# EAGLE design BME280-Breakout_v13 (EAGLE 7.7.0)
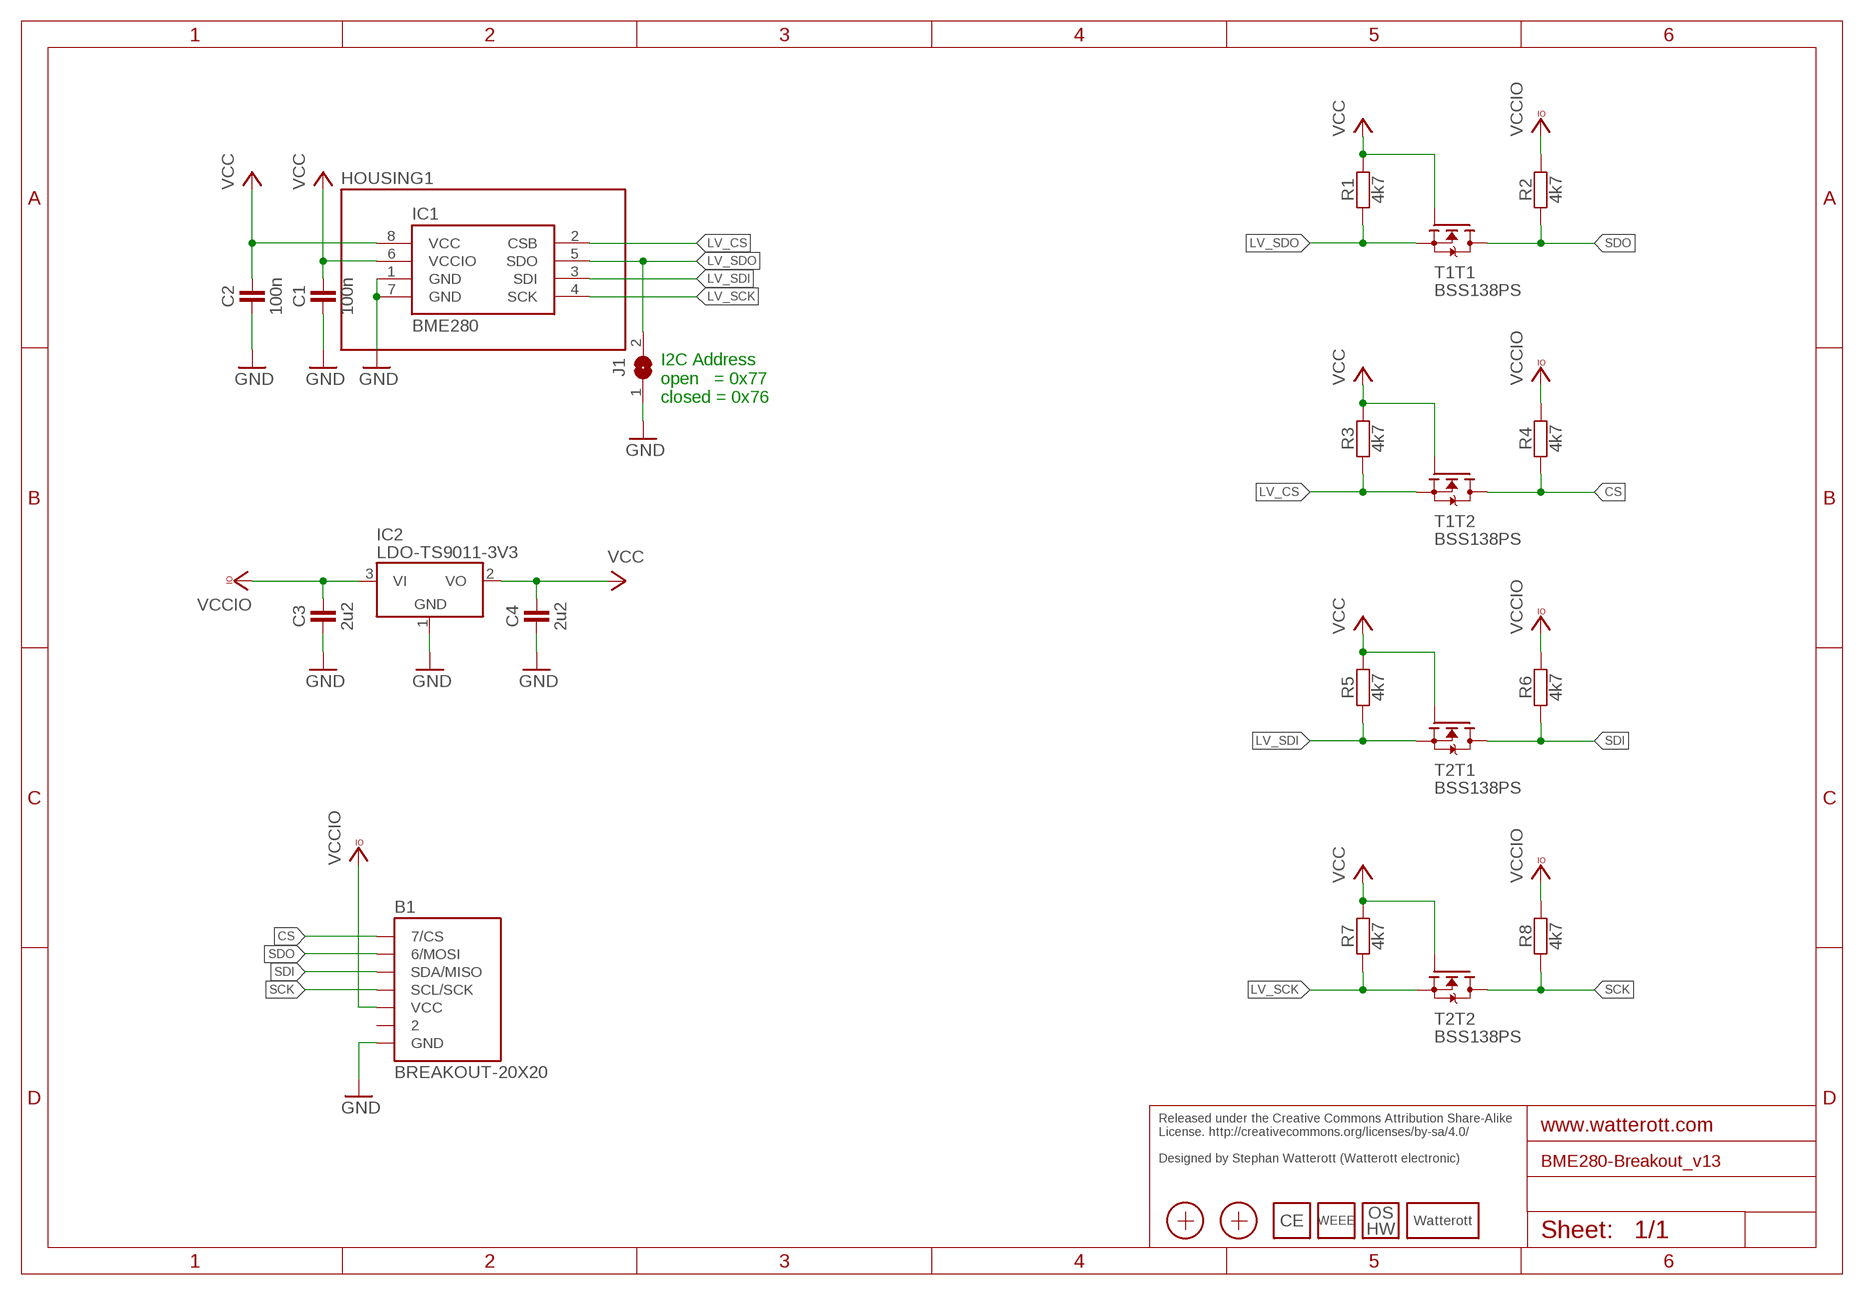
[diagram p0: schematic, sheet 1]

## Parts
B1  BREAKOUT-20X20  [BREAKOUT-20X20]
C1  100n  CAPACITOR-0402  [C0402]
C2  100n  CAPACITOR-0402  [C0402]
C3  2u2  CAPACITOR-0402  [C0402]
C4  2u2  CAPACITOR-0402  [C0402]
HOUSING1  SF2  [SF2]
IC1  BME280  [BME280]
IC2  LDO-TS9011-3V3  [SOT23]
J1  JUMPER2-0603  [JUMPER2-0603]
LOGO3  LOGO_CE-2  [CE_2MM]
LOGO4  LOGO_WEEE-4  [WEEE_4MM]
LOGO5  LOGO_SPARK-2  [SPARK_2MM]
LOGO6  LOGO_OSHW-2  [OSHW_2MM]
R1  4k7  RESISTOR-0402  [C0402]
R2  4k7  RESISTOR-0402  [C0402]
R3  4k7  RESISTOR-0402  [C0402]
R4  4k7  RESISTOR-0402  [C0402]
R5  4k7  RESISTOR-0402  [C0402]
R6  4k7  RESISTOR-0402  [C0402]
R7  4k7  RESISTOR-0402  [C0402]
R8  4k7  RESISTOR-0402  [C0402]
T1  BSS138PS  [SOT363]
T2  BSS138PS  [SOT363]
X1  PASSER-07  [PASSER_07MM]
X2  PASSER-07  [PASSER_07MM]

## Nets
CS: B1.CS(7/CS) R4.1 T1.3(T2:D)
GND: B1.GND C1.1 C2.1 C3.1 C4.1 IC1.1(GND) IC1.7(GND) IC2.1(GND) J1.1
LV_CS: IC1.2(CSB) R3.1 T1.4(T2:S)
LV_SCK: IC1.4(SCK) R7.1 T2.4(T2:S)
LV_SDI: IC1.3(SDI) R5.1 T2.1(T1:S)
LV_SDO: IC1.5(SDO) J1.2 R1.1 T1.1(T1:S)
SCK: B1.SCL/SCK R8.1 T2.3(T2:D)
SDI: B1.SDA/MISO R6.1 T2.6(T1:D)
SDO: B1.MOSI(6/MOSI) R2.1 T1.6(T1:D)
VCC: C1.2 C2.2 C4.2 IC1.6(VCCIO) IC1.8(VCC) IC2.2(VO) R1.2 R3.2 R5.2 R7.2 T1.2(T1:G) T1.5(T2:G) T2.2(T1:G) T2.5(T2:G)
VCCIO: B1.VCC C3.2 IC2.3(VI) R2.2 R4.2 R6.2 R8.2
Unconnected: B1.2

## Notes on the sheet
- I2C Address
  open   = 0x77
  closed = 0x76
- Released under the Creative Commons Attribution Share-Alike 
  License. http://creativecommons.org/licenses/by-sa/4.0/
  
  Designed by Stephan Watterott (Watterott electronic)

## Library data of the parts
B1 = we-board:BREAKOUT: Breakout Template
C1-C4 = we-rcl:CAPACITOR: Capacitor ...2.2uF @ 6.3V -> 0402 ...4.7uF @ 6.3V -> 0603 ...10uF @ 16V -> 0805 ...22uF @ 25V -> 1206
HOUSING1 = we-sensor:SF2: Sensirion SF2 Filter Cab (Housing for Humidity Sensors)
IC1 = we-sensor:BME280: Bosch BME280 Temperature, Pressure, Humidity Sensor
IC2 = we-power:LDO: LDOs TS1117 800mA, Vin max 12V - compatible NCP1117 1A, Vin max 20V TS9011 250mA, Vin max 12V - compatible AP2210 300mA, Vin max 15V TS5204 150mA, Vin max 16V
J1 = we-rcl:JUMPER2: 2-Pin Jumper
LOGO3 = we-symbol:LOGO_CE: CE Logo
LOGO4 = we-symbol:LOGO_WEEE: WEEE Logo
LOGO5 = we-symbol:LOGO_SPARK: Watterott electronic Logo
LOGO6 = we-symbol:LOGO_OSHW: Open-Source-Hardware Logo
R1-R8 = we-rcl:RESISTOR: Resistor all kinds in 0402 and 0603
T1 T2 = we-transistor:BSS138PS: BSS138 Dual N-Channel MOSFET (UGS +/-20V, RDS 1Ohm, ID 320mA)
X1 X2 = we-symbol:PASSER: Fiducial Markers

## Board
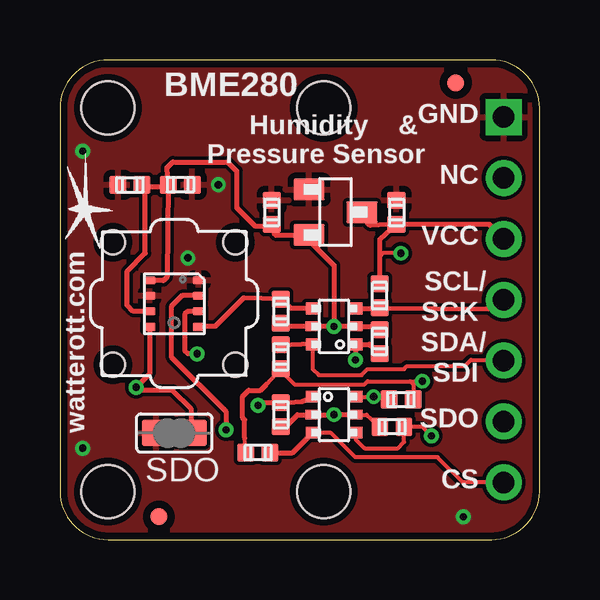
[diagram p1: board, top side]
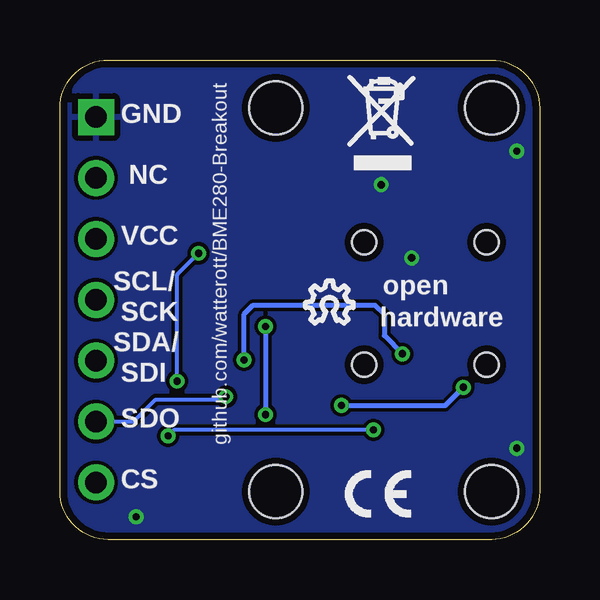
[diagram p2: board, bottom side, seen from below]

Size 20 x 20 mm. Coordinates in mm from the lower left corner, seen from the top.
Copper layers (1*16): Top 0.035mm / dielectric 1.5mm / Bottom 0.035mm
Design rules "we-dru-2-layer *": minimum track width 0.15mm, minimum drill 0.3mm, track to track 0.15mm, track to pad 0.15mm, pad to pad 0.15mm, via to via 0.15mm, smd to smd 0.1mm, copper to edge 0.3mm, drill to drill 0.2mm, minimum pad ring 0.18mm, minimum via ring 0.16mm, stop-mask expansion 0.1mm, vias tented up to drill 0.5mm, thermal gap 0.25mm
Holes 2.2 mm at 11,18 11,2

### Footprints (pad centres in the part's own frame; a part is rotated, then mirrored left to right if it is on the bottom)
BREAKOUT-20X20 = drill 0.9 pad 1.5: 2 18.5,15.08; CS 18.5,2.38; MOSI 18.5,4.92; SCL/SCK 18.5,10; SDA/MISO 18.5,7.46; VCC 18.5,12.54 | drill 0.9 pad 1.5 square: GND 18.5,17.62 | hole 2.2: 2,18; 2,2
C0402 = smd 0.75 x 0.7: 1 0,0.5; 2 0,-0.5
SF2 = hole 1: -2.55,-2.55; 2.55,-2.55; 2.55,2.55; -2.55,2.55
BME280 = smd 0.5 x 0.35: 1 1.025,0.975; 2 1.025,0.325; 3 1.025,-0.325; 4 1.025,-0.975; 5 -1.025,-0.975; 6 -1.025,-0.325; 7 -1.025,0.325; 8 -1.025,0.975
SOT23 = smd 1.3 x 0.9: 1 -1.1,0.95; 2 -1.1,-0.95; 3 1.1,0
JUMPER2-0603 = smd 1.1 x 1.2: 1 0,0.75; 2 0,-0.75
SOT363 = smd 0.6 x 0.5: 1 -0.9,0.75; 3 -0.9,-0.75; 4 0.9,-0.75; 6 0.9,0.75 | smd 0.6 x 0.4: 2 -0.9,0; 5 0.9,0
PASSER_07MM = smd 0.7 x 0.7: X 0,0

### Placement (x,y rotation side)
B1  0,0 0 top
C1  5.02,14.8 270 top
C2  2.92,14.8 90 top
C3  14.03,13.65 0 top
C4  8.83,13.65 0 top
HOUSING1  4.76,9.84 0 top
IC1  4.76,9.84 0 top
IC2  11.49,13.65 0 top
J1  4.76,4.45 90 top
LOGO3  6.73,1.91 0 bottom
LOGO4  6.6,17.4 0 bottom
LOGO5  1.02,13.78 90 top
LOGO6  8.76,9.91 0 bottom
R1  9.21,5.21 0 top
R2  14.22,5.84 90 top
R3  13.84,4.7 270 top
R4  8.26,3.62 270 top
R5  13.34,8.26 180 top
R6  9.21,7.62 0 top
R7  9.21,9.53 0 top
R8  13.34,10.16 180 top
T1  11.43,5.21 0 top
T2  11.43,8.89 180 top
X1  16.51,19.05 0 top
X2  4.13,0.95 0 top

### Tracks (layer width: path | path; a pad name or v marks a point on that pad's centre or on a via)
CS
  Top 0.17: B1.CS 16.8,2.38 15.75,3.43 12.32,3.43 11.3,4.45 10.54,4.45 T1.3
  Top 0.2: R4.1 9.69,3.62 T1.3
GND  (via drill 0.3)
  other vias: 5.33,11.75 6.6,14.8 0.95,3.81 0.95,16.19 16.83,0.95
  pour Bottom: 0,0 0,20 20,20 20,0
  pour Top: 0,0 0,20 20,20 20,0
LV_CS  (via drill 0.3)
  Top 0.17: T1.4 12.33,4.18 12.7,3.81 14.1,3.81 14.35,4.06 14.35,4.66 R3.1 15.11,4.7 v15.49,4.32
  Top 0.2: IC1.2 5.09,10.17 4.64,9.72 4.64,7.62 6.92,5.33 v6.92,4.57
  Bottom 0.17: 6.99,4.57 15.24,4.57 v15.49,4.32
  Bottom 0.2: v6.92,4.57 6.99,4.57
LV_SCK
  Top 0.2: T2.4 9.64,9.64 R7.1 7.66,10.07 6.48,8.89 5.81,8.89 IC1.4
LV_SDI  (via drill 0.3)
  Top 0.2: R5.1 12.9,8.14 T2.1 12.33,7.5 v12.32,7.49 | IC1.3 5.33,9.52 5.21,9.4 5.21,7.87 5.33,7.75 v5.71,7.75
  Bottom 0.2: v12.32,7.49 12.32,9.4 11.94,9.78 6.86,9.78 6.48,9.4 6.48,8.51 v5.71,7.75
LV_SDO  (via drill 0.3)
  Top 0.2: T1.1 10.1,5.76 R1.1 9.16,5.71 8.51,5.71 8.38,5.59 v8.26,5.59 | J1.2 5.46,4.51 5.46,5.46 4.7,6.22 3.3,6.22 v3.17,6.35 3.74,6.91 IC1.5
  Bottom 0.2: v8.26,5.59 3.94,5.59 v3.17,6.35
SCK
  Top 0.2: T2.3 13.3,9.64 R8.1 18.11,9.61 B1.SCL/SCK
SDI
  Top 0.17: 10.54,8.13 10.54,7.11 10.79,6.86 12.57,6.86 12.83,7.11 14.35,7.11 14.48,7.24 16.89,7.24 17.14,7.49 18.47,7.49 B1.SDA/MISO
  Top 0.2: R6.1 10.5,8.17 T2.6 10.54,8.13
SDO  (via drill 0.3)
  Top 0.17: T1.6 v13.08,5.96 13.56,5.96 R2.1
  Bottom 0.17: B1.MOSI 16.92,4.92 16,5.84 13.2,5.84 v13.08,5.96
VCC  (via drill 0.3)
  Top 0.17: T1.5 12.79,5.21 R3.2
  Top 0.2: R5.2 13.25,8.89 T2.2 v11.43,8.89 | v11.43,8.89 T2.5 9.29,8.89 R7.2 | v11.43,8.89 11.43,11.43 10.16,12.7 IC2.2 8.97,12.7 C4.2 8.55,13.08 8.13,13.08 7.37,13.84 7.37,15.37 6.99,15.75 4.7,15.75 4.47,15.52 C1.2 | T1.5 v11.43,5.21 T1.2 9.91,5.21 9.36,4.66 R1.2 | C1.2 4.47,10.94 4.32,10.79 3.76,10.79 IC1.8 | IC1.6 3.06,9.52 2.79,9.78 2.79,11.18 3.56,11.94 3.56,14.71 | 3.56,14.71 C2.2 | 3.56,14.71 4.38,14.71 C1.2
  Bottom 0.2: v11.43,8.89 v11.43,5.21
VCCIO  (via drill 0.3)
  Top 0.17: R4.2 7.71,4.23 | 8.61,6.48 R6.2 9.21,7.05 9.78,6.48 12.7,6.48 12.83,6.6 14.61,6.6 | 14.61,6.6 14.73,6.48 14.73,5.88 R2.2 | 14.61,6.6 v15.11,6.6 | v14.22,11.94 13.46,11.94 13.34,11.81
  Top 0.2: C3.2 12.93,13.1 12.7,13.34 12.53,13.34 IC2.3 | R8.2 13.34,11.81 13.34,12.53 C3.2 | C3.2 17.91,13.15 17.91,13.11 17.94,13.1 B1.VCC | 7.71,4.23 7.71,5 7.62,5.08 7.62,5.97 7.87,6.22 8.36,6.22 8.61,6.48
  Bottom 0.17: v15.11,6.6 15.11,11.05 v14.22,11.94

### Text on the board
tPlace: BME280 | Humidity & / Pressure Sensor | GND | NC | VCC | SCL/ | SCK | SDA/ | SDI | SDO | watterott.com | CS | SDO
bPlace: github.com/watterott/BME280-Breakout | GND | NC | VCC | SCL/ | open | SCK | hardware | SDA/ | SDI | SDO | CS